# EAGLE design PCB-Main (EAGLE 9.3.1)
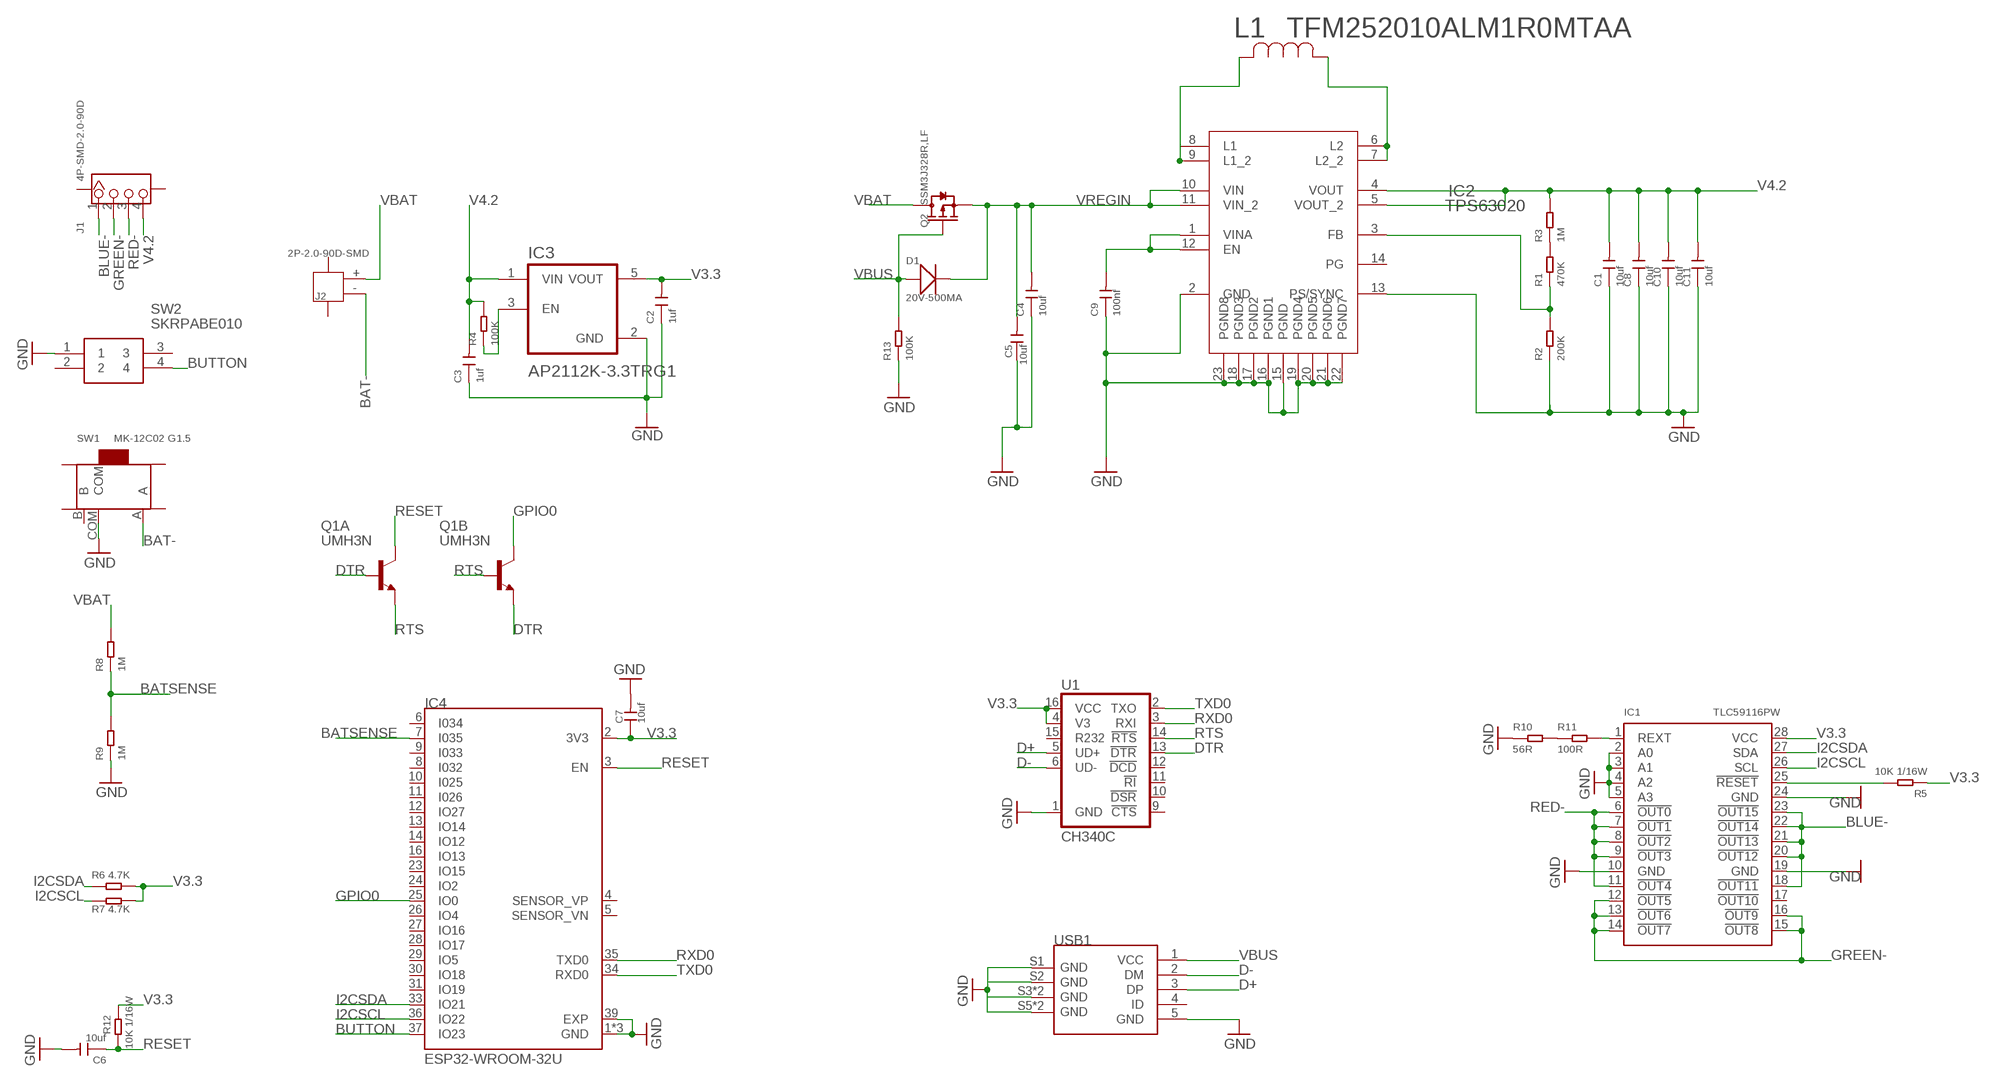
[diagram p0: schematic, sheet 1]

## Parts
C1  10uf  CERAMIC-10UF-6.3V-20%-X5R(0402)  [C0402]
C2  1uf  CERAMIC-1UF-10V-10%-X5R(0402)  [C0402]
C3  1uf  CERAMIC-1UF-10V-10%-X5R(0402)  [C0402]
C4  10uf  CERAMIC-10UF-6.3V-20%-X5R(0402)  [C0402]
C5  10uf  CERAMIC-10UF-6.3V-20%-X5R(0402)  [C0402]
C6  10uf  CERAMIC-10UF-6.3V-20%-X5R(0402)  [C0402]
C7  10uf  CERAMIC-10UF-6.3V-20%-X5R(0402)  [C0402]
C8  10uf  CERAMIC-10UF-6.3V-20%-X5R(0402)  [C0402]
C9  100nf  CERAMIC-100NF-25V-10%-X7R(0402)  [C0402]
C10  10uf  CERAMIC-10UF-6.3V-20%-X5R(0402)  [C0402]
C11  10uf  CERAMIC-10UF-6.3V-20%-X5R(0402)  [C0402]
D1  20V-500MA  SMD-DIODE-SCHOTTKY-20V-500MA(SOD-123)  [SOD-123]
IC1  TLC59116PW  [PW_R-PDSO-G28]
IC2  TPS63020  [QFN14-3X4MM]
IC3  AP2112K-3.3TRG1  [SOT95P285X140-5N]
IC4  ESP32-WROOM-32U  ESP32-WROOM-32UNOSD  [XCVR_ESP32-WROOM-32U]
J1  4P-SMD-2.0-90D  GROVE-CONNECTOR-SMD-90D(4+2P-2.0)  [HW4-SMD-2.0-90D]
J2  2P-2.0-90D-SMD  CONN-HEADER-SMD-PH-SIDE-(2P-2.0MM)  [HW2-SMD-2.0-90D]
L1  TFM252010ALM1R0MTAA  [IND_1008]
Q1  UMH3N  [UMT6]
Q2  SSM3J328R,LF  SMD-MOSFET-P-CH-20V-6A-SSM3J328R(SOT-23)  [SOT-23]
R1  470K  SMD-RES-470K-1%-1/16W(0402)  [R0402]
R2  200K  SMD-RES-200K-5%-1/16W(0402)  [R0402]
R3  1M  SMD-RES-1M-1%-1/16W(0402)  [R0402]
R4  100K  SMD-RES-100K-1%-1/16W(0402)  [R0402]
R5  10K 1/16W  SMD-RES-10K-1%-1/16W(0402)  [R0402]
R6  4.7K  SMD-RES-4.7K-5%-1/16W(0402)  [R0402]
R7  4.7K  SMD-RES-4.7K-5%-1/16W(0402)  [R0402]
R8  1M  SMD-RES-1M-1%-1/16W(0402)  [R0402]
R9  1M  SMD-RES-1M-1%-1/16W(0402)  [R0402]
R10  56R  SMD-RES-56Ω-1%-1/16W(0402)  [R0402]
R11  100R  SMD-RES-100R-5%-1/16W(0402)  [R0402]
R12  10K 1/16W  SMD-RES-10K-1%-1/16W(0402)  [R0402]
R13  100K  SMD-RES-100K-1%-1/16W(0402)  [R0402]
SW1  MK-12C02 G1.5  SMD-TOGGLE-SWITCH-ON-ON(3+4P-6.7X2.7MM)  [SW7-SMD-L6.7X2.7X3.2MM]
SW2  SKRPABE010  [SMT(4.2X3.2)]
U1  CH340C  [SO016]
USB1  10118193-0001LF  MICRO-USB-SMD-B-(10118193-0001LF)  [MICRO-USB5+6P-SMD-0.65-B]

## Nets
BAT-: J2.- SW1.A
BATSENSE: IC4.7(I035) R8.1 R9.2
BLUE-: IC1.18(!OUT11) IC1.20(!OUT12) IC1.21(!OUT13) IC1.22(!OUT14) IC1.23(!OUT15) J1.1
BUTTON: IC4.37(IO23) SW2.4
D+: U1.5(UD+) USB1.3(DP)
D-: U1.6(UD-) USB1.2(DM)
DTR: Q1.2(A:B) Q1.4(B:E) U1.13(!DTR)
GND: C1.1 C2.1 C3.1 C4.1 C5.1 C6.2 C7.2 C8.1 C9.1 C10.1 C11.1 IC1.2(A0) IC1.3(A1) IC1.4(A2) IC1.5(A3) IC1.10(GND) IC1.19(GND) IC1.24(GND) IC2.2(GND) IC2.13(PS/SYNC) IC2.15(PGND) IC2.16(PGND1) IC2.17(PGND2) IC2.18(PGND3) IC2.19(PGND4) IC2.20(PGND5) IC2.21(PGND6) IC2.22(PGND7) IC2.23(PGND8) IC3.2(GND) IC4.1(GND) IC4.15(GND) IC4.38(GND) IC4.39(EXP) R2.1 R9.1 R10.1 R13.1 SW1.COM SW2.1 U1.1(GND) USB1.5(GND) USB1.S1(GND) USB1.S2(GND) USB1.S3(GND) USB1.S4(GND) USB1.S5(GND) USB1.S6(GND)
GPIO0: IC4.25(IO0) Q1.3(B:C)
GREEN-: IC1.12(!OUT5) IC1.13(!OUT6) IC1.14(!OUT7) IC1.15(!OUT8) IC1.16(!OUT9) J1.2
I2CSCL: IC1.26(SCL) IC4.36(IO22) R7.1
I2CSDA: IC1.27(SDA) IC4.33(IO21) R6.1
N$1: C9.2 IC2.1(VINA) IC2.12(EN)
N$2: IC1.1(REXT) R11.2
N$3: R1.2 R3.1
N$4: IC3.3(EN) R4.1
N$5: R10.2 R11.1
N$6: IC2.8(L1) IC2.9(L1_2) L1.2
N$7: IC1.25(!RESET) R5.2
N$8: IC2.6(L2) IC2.7(L2_2) L1.1
N$11: IC2.3(FB) R1.1 R2.2
RED-: IC1.6(!OUT0) IC1.7(!OUT1) IC1.8(!OUT2) IC1.9(!OUT3) IC1.11(!OUT4) J1.3
RESET: C6.1 IC4.3(EN) Q1.6(A:C) R12.1
RTS: Q1.1(A:E) Q1.5(B:B) U1.14(!RTS)
RXD0: IC4.35(TXD0) U1.3(RXI)
TXD0: IC4.34(RXD0) U1.2(TXO)
V3.3: C2.2 C7.1 IC1.28(VCC) IC3.5(VOUT) IC4.2(3V3) R5.1 R6.2 R7.2 R12.2 U1.4(V3) U1.16(VCC)
V4.2: C1.2 C3.2 C8.2 C10.2 C11.2 IC2.4(VOUT) IC2.5(VOUT_2) IC3.1(VIN) J1.4 R3.2 R4.2
VBAT: J2.+ Q2.3(D) R8.2
VBUS: D1.+ Q2.1(G) R13.2 USB1.1(VCC)
VREGIN: C4.2 C5.2 D1.- IC2.10(VIN) IC2.11(VIN_2) Q2.2(S)
Unconnected: IC1.17(!OUT10) IC2.14(PG) IC4.4(SENSOR_VP) IC4.5(SENSOR_VN) IC4.6(I034) IC4.8(I032) IC4.9(I033) IC4.10(I025) IC4.11(I026) IC4.12(IO27) IC4.13(IO14) IC4.14(IO12) IC4.16(IO13) IC4.23(IO15) IC4.24(IO2) IC4.26(IO4) IC4.27(IO16) IC4.28(IO17) IC4.29(IO5) IC4.30(IO18) IC4.31(IO19) J1.SS1 J1.SS2 J2.3 J2.4 SW1.B SW1.SS1 SW1.SS2 SW1.SS3 SW1.SS4 SW2.2 SW2.3 U1.9(!CTS) U1.10(!DSR) U1.11(!RI) U1.12(!DCD) U1.15(R232) USB1.4(ID)

## Library data of the parts
C1 C4-C8 C10 C11 = OPL_Capacitor:CERAMIC-10UF-6.3V-20%-X5R(0402): 302010053; MPN: CC0402MRX5R5BB106
C2 C3 = OPL_Capacitor:CERAMIC-1UF-10V-10%-X5R(0402): 302010040; MPN: CC0402KRX5R6BB105
C9 = OPL_Capacitor:CERAMIC-100NF-25V-10%-X7R(0402): 302010024; MPN: CC0402KRX7R8BB104
D1 = OPL_Discrete_Semiconductor:SMD-DIODE-SCHOTTKY-20V-500MA(SOD-123): 304020032; MPN: SS0520-7-F
IC1 = rfglow-esp32:TLC59116: TLC59116IPWR; MPN: TLC59116IPWR; URL: https://lcsc.com/product-detail/LED-Drivers_TI_TLC59116IPWR_TLC59116IPWR_C131194.html
IC2 = rfglow-esp32:TPS63020: TPS63020DSJR; DESCRIPTION: High Efficiency Single Inductor Buck-Boost Converter with 4A Switch; MF: Texas Instruments; MPN: TPS63020DSJR; PACKAGE: VSON-14 Texas Instruments; URL: https://lcsc.com/product-detail/DC-DC-Converters_TI_TPS63020DSJR_TPS63020DSJR_C15483.html
IC3 = rfglow-esp32:AP2112K-3.3TRG1: AP2112K-3.3TRG1; AVAILABILITY: Unavailable; DESCRIPTION: AP2112 Series 0.6 A 3.3 V Fixed Output SMT LDO Linear Regulator - SOT23-5; MF: Diodes Inc.; MP: AP2112K-3.3TRG1; PACKAGE: SOT-753 Diodes Inc.; PRICE: None
IC4 = rfglow-esp32:ESP32-WROOM-32U: Wi-Fi/BT BLE Module ESP32-D0WD SPI Flash UART U.FL Conn.; AVAILABILITY: Unavailable; DESCRIPTION: Wi-Fi/BT BLE Module ESP32-D0WD SPI Flash UART U.FL Conn.; MF: Espressif Systems; MP: ESP32-WROOM-32U; PACKAGE: Module Espressif Systems; PRICE: None
J1 = OPL_Connector:GROVE-CONNECTOR-SMD-90D(4+2P-2.0): 320110032
J2 = OPL_Connector:CONN-HEADER-SMD-PH-SIDE-(2P-2.0MM): 320110026
L1 = rfglow-esp32:TFM252010ALM1R0MTAA: 303010527
Q1 = rfglow-esp32:UMH3N: UMH3NTN; MPN: UMH3NTN; URL: https://lcsc.com/product-detail/Digital-Transistors_ROHM_UMH3NTN_UMH3NTN_C123008.html
Q2 = OPL_Discrete_Semiconductor:SMD-MOSFET-P-CH-20V-6A-SSM3J328R(SOT-23): 305030075; MPN: SSM3J328R,LF
R1 = OPL_Resistor:SMD-RES-470K-1%-1/16W(0402): 301010069; MPN: RC0402FR-07470KL
R2 = OPL_Resistor:SMD-RES-200K-5%-1/16W(0402): 301012017; MPN: RC0402JR-070RL; VALUE: 0R
R3 R8 R9 = rfglow-esp32:SMD-RES-1M-1%-1/16W(0402): 301010043; MPN: RC0402FR-071ML
R4 R13 = OPL_Resistor:SMD-RES-100K-1%-1/16W(0402): 301010456; MPN: RC0402FR-07100KL
R5 R12 = OPL_Resistor:SMD-RES-10K-1%-1/16W(0402): 301010047; MPN: RC0402FR-0710KL
R6 R7 = rfglow-esp32:SMD-RES-4.7K-5%-1/16W(0402): 301010010; MPN: RC0402JR-074K7L
R10 = rfglow-esp32:SMD-RES-56Ω-1%-1/16W(0402): RC0402FR-0756RL; MPN: RC0402FR-0756RL
R11 = rfglow-esp32:SMD-RES-100R-5%-1/16W(0402): 301010028; MPN: RC0402JR-07100RL
SW1 = OPL_Switch:SMD-TOGGLE-SWITCH-ON-ON(3+4P-6.7X2.7MM): 311030001; MPN: MK-12C02 G1.5
SW2 = rfglow-esp32:SKRPABE010: 311020518; DESCRIPTION: Switch Tactile 4.2 x 3.2mm SMT 1.57N Black Button Tactile Switch, SPST-NO 0.05 A 0.7mm; HEIGHT: mm; MANUFACTURER_NAME: ALPS; MANUFACTURER_PART_NUMBER: SKRPABE010; MOUSER_PART_NUMBER: 688-SKRPAB; MOUSER_PRICE-STOCK: https://www.mouser.com/Search/Refine.aspx?Keyword=688-SKRPAB; RS_PART_NUMBER: 9174087; RS_PRICE-STOCK: http://uk.rs-online.com/web/p/products/9174087
U1 = rfglow-esp32:CH340C: CH340C; MPN: CH340C; PROD_ID: IC-14038; URL: https://lcsc.com/product-detail/USB_CH340C_C84681.html
USB1 = OPL_Connector:MICRO-USB-SMD-B-(10118193-0001LF): 320010003; MPN: 10118193-0001LF

## Board
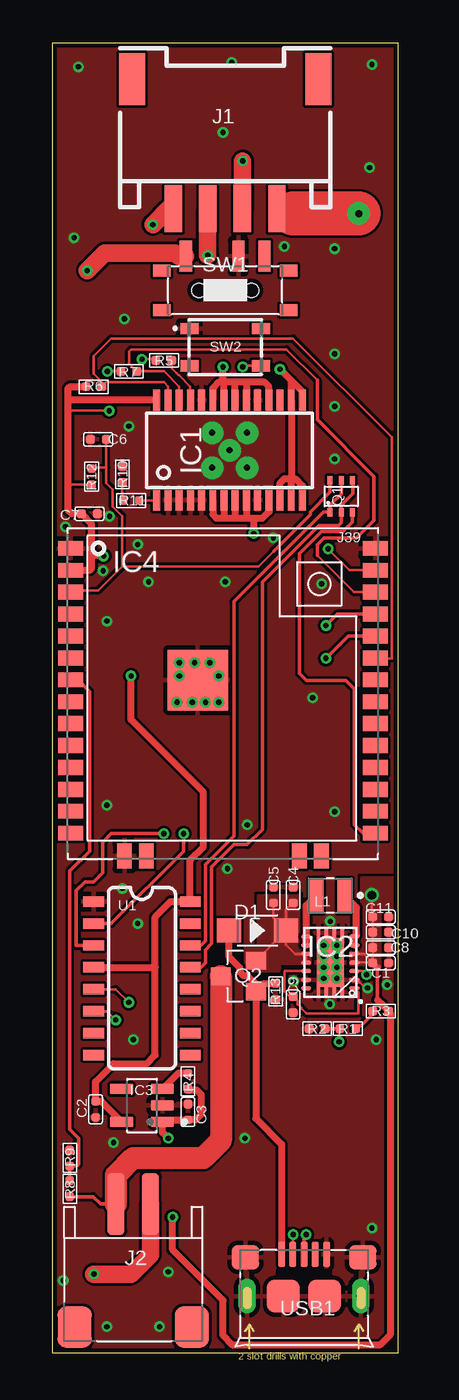
[diagram p1: board, top side]
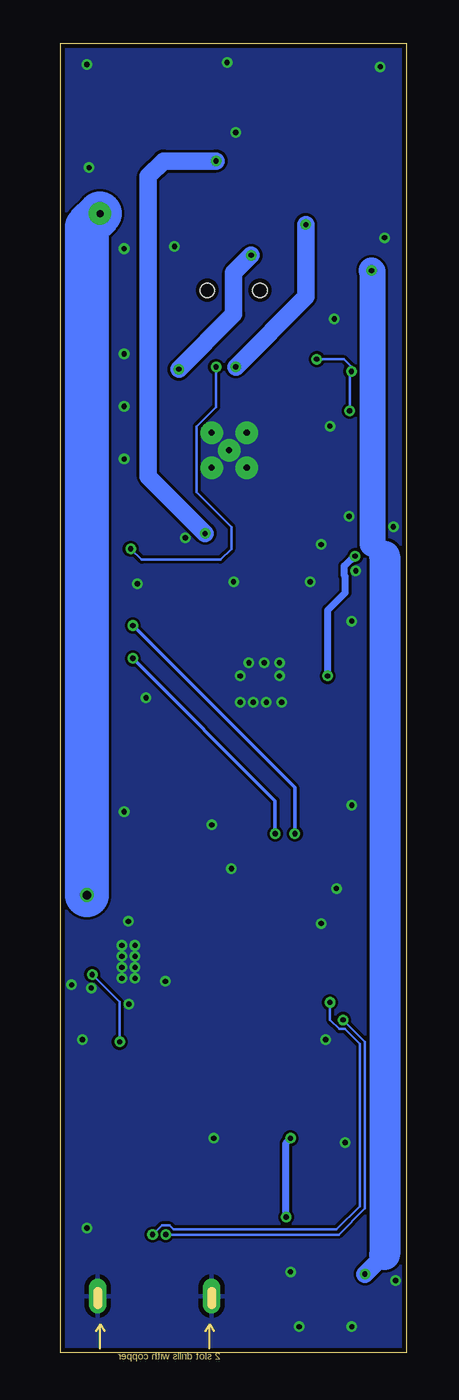
[diagram p2: board, bottom side, seen from below]

Size 20.07 x 75.92 mm. Coordinates in mm from the lower left corner, seen from the top.
Outline: 0,0 20.07,0 20.07,75.92 0,75.92 0,0
Copper layers (1*16): Top 0.035mm / dielectric 1.5mm / Bottom 0.035mm
Design rules "SeeedStudio_2layer_DRU_no_angle_20140221 *": minimum track width 6mil, minimum drill 12mil, track to track 6mil, track to pad 6mil, pad to pad 6mil, via to via 6mil, smd to smd 0mil, copper to edge 10mil, drill to drill 10mil, minimum pad ring 10mil, minimum via ring 6mil, stop-mask expansion 2mil, vias tented up to drill 100mil, thermal gap 10mil

### Footprints (pad centres in the part's own frame; a part is rotated, then mirrored left to right if it is on the bottom)
C0402 = smd 0.5 x 0.5: 1 0,0.463; 2 0,-0.463
SOD-123 = smd 1.397 x 1.397: + -1.651,0; - 1.651,0
PW_R-PDSO-G28 = smd 0.4 x 1.2: 1 -4.225,-2.9; 2 -3.575,-2.9; 3 -2.925,-2.9; 4 -2.275,-2.9; 5 -1.625,-2.9; 6 -0.975,-2.9; 7 -0.325,-2.9; 8 0.325,-2.9; 9 0.975,-2.9; 10 1.625,-2.9; 11 2.275,-2.9; 12 2.925,-2.9; 13 3.575,-2.9; 14 4.225,-2.9; 15 4.225,2.9; 16 3.575,2.9; 17 2.925,2.9; 18 2.275,2.9; 19 1.625,2.9; 20 0.975,2.9; 21 0.325,2.9; 22 -0.325,2.9; 23 -0.975,2.9; 24 -1.625,2.9; 25 -2.275,2.9; 26 -2.925,2.9; 27 -3.575,2.9; 28 -4.225,2.9
QFN14-3X4MM = smd 0.6 x 0.24: 1 -1.4,1.5; 2 -1.4,1; 3 -1.4,0.5; 4 -1.4,0; 5 -1.4,-0.5; 6 -1.4,-1; 7 -1.4,-1.5; 8 1.4,-1.5; 9 1.4,-1; 10 1.4,-0.5; 11 1.4,0; 12 1.4,0.5; 13 1.4,1; 14 1.4,1.5 | smd 1.58 x 2.85: 15 0,0 | smd 0.2 x 0.575: 16 -0.69,1.712; 17 -0.23,1.712; 18 0.23,1.712; 19 0.69,1.712; 20 0.69,-1.712; 21 0.23,-1.712; 22 -0.23,-1.712; 23 -0.69,-1.712
SOT95P285X140-5N = smd 1.35 x 0.6: 1 -1.185,0.95; 2 -1.185,0; 3 -1.185,-0.95; 4 1.185,-0.95; 5 1.185,0.95
XCVR_ESP32-WROOM-32U = smd 1.45 x 0.86: 1 -8.83,8.41; 2 -8.83,7.14; 3 -8.83,5.87; 4 -8.83,4.6; 5 -8.83,3.33; 6 -8.83,2.06; 7 -8.83,0.79; 8 -8.83,-0.48; 9 -8.83,-1.75; 10 -8.83,-3.02; 11 -8.83,-4.29; 12 -8.83,-5.56; 13 -8.83,-6.83; 14 -8.83,-8.1; 25 8.83,-8.1; 26 8.83,-6.83; 27 8.83,-5.56; 28 8.83,-4.29; 29 8.83,-3.02; 30 8.83,-1.75; 31 8.83,-0.48; 32 8.83,0.79; 33 8.83,2.06; 34 8.83,3.33; 35 8.83,4.6; 36 8.83,5.87; 37 8.83,7.14; 38 8.83,8.41 | smd 0.86 x 1.45: 15 -5.715,-9.43; 16 -4.445,-9.43; 23 4.445,-9.43; 24 5.715,-9.43 | smd 3.5 x 3.5: 39 -1.46,0.77
HW4-SMD-2.0-90D = smd 1.01 x 2.74: 1 -3,-0.1; 2 -1,-0.1; 3 1,-0.1; 4 3,-0.1 | smd 1.5 x 3: SS1 -5.4,7.4; SS2 5.4,7.4
HW2-SMD-2.0-90D = smd 2 x 2.4: 3 3.4,-2.181; 4 -3.4,-2.181 | smd 1 x 3.6: + -1,4.953; - 1,4.953
IND_1008 = smd 0.85 x 2: 1 -0.825,0; 2 0.825,0
UMT6 = smd 0.5 x 0.3: 1 -0.925,0.65; 2 -0.925,0; 3 -0.925,-0.65; 4 0.925,-0.65; 5 0.925,0; 6 0.925,0.65
SOT-23 = smd 1.016 x 1.143: 1 -0.889,-1.016; 2 0.889,-1.016; 3 0,1.016
R0402 = smd 0.5 x 0.5: 1 0,0.463; 2 0,-0.463
SW7-SMD-L6.7X2.7X3.2MM = smd 1.8 x 0.7: A 1.978,2.286; B 1.978,-2.286; COM 1.978,-0.762 | smd 0.7 x 1.016: SS1 -1.15,-3.683; SS2 1.15,-3.683; SS3 1.15,3.683; SS4 -1.15,3.683 | hole 0.813: 0,-1.524; 0,1.524
SMT(4.2X3.2) = smd 1.05 x 0.65: 1 -2.075,1.075; 2 2.075,1.075; 3 -2.075,-1.075; 4 2.075,-1.075
SO016 = smd 0.6 x 1.2: 1 -4.445,-2.8; 2 -3.175,-2.8; 3 -1.905,-2.8; 4 -0.635,-2.8; 5 0.635,-2.8; 6 1.905,-2.8; 7 3.175,-2.8; 8 4.445,-2.8; 9 4.445,2.8; 10 3.175,2.8; 11 1.905,2.8; 12 0.635,2.8; 13 -0.635,2.8; 14 -1.905,2.8; 15 -3.175,2.8; 16 -4.445,2.8
MICRO-USB5+6P-SMD-0.65-B = smd 0.4 x 1.5: 1 -1.3,-0.25; 2 -0.65,-0.25; 3 0,-0.25; 4 0.65,-0.25; 5 1.3,-0.25 | smd 1.6 x 1.4: S1 -3.4,-0.427; S6 3.4,-0.427 | drill 0.508 pad 1.016 long: S2 -3.3,-2.675; S5 3.3,-2.675 | smd 1.9 x 1.9: S3 -1.2,-2.675; S4 1.2,-2.675

### Placement (x,y rotation side)
C1  19.05,22.61 270 top
C2  2.51,14.12 180 top
C3  7.87,13.97 0 top
C4  13.97,26.54 0 top
C5  12.83,26.54 0 top
C6  2.67,52.96 270 top
C7  2.16,48.64 90 top
C8  19.05,23.5 270 top
C9  13.97,20.19 180 top
C10  19.05,24.38 270 top
C11  19.05,25.27 270 top
D1  11.91,24.49 0 top
IC1  10.29,52.32 0 top
IC2  16.13,22.63 180 top
IC3  5.21,14.35 180 top
IC4  9.9,38.23 0 top
J1  10.03,66.42 0 top
J2  4.7,3.68 0 top
L1  16.13,26.52 180 top
Q1  16.76,49.66 90 top
Q2  10.79,21.84 90 top
R1  17.14,18.8 90 top
R2  15.37,18.8 90 top
R3  19.05,19.81 90 top
R4  7.87,15.75 0 top
R5  6.48,57.53 90 top
R6  2.41,56.01 270 top
R7  4.45,56.9 270 top
R8  1.02,9.53 0 top
R9  1.02,11.3 0 top
R10  4.06,50.93 0 top
R11  4.57,49.4 90 top
R12  2.29,50.8 0 top
R13  12.95,20.95 180 top
SW1  10.03,61.59 90 top
SW2  10.03,58.29 0 top
U1  5.21,21.72 270 top
USB1  14.61,5.97 0 top

### Tracks (layer width: path | path; a pad name or v marks a point on that pad's centre or on a via)
BAT-  (via drill 0.3)
  Top 1.016: SW1.A 7.31,63.57 7.13,63.76 3.05,63.76 v2.03,62.74 | v2.41,4.57 4.57,4.57 5.7,5.7 J2.-
  Bottom 1.016: 1.98,46.89 1.27,46.18 | 1.27,5.71 v2.41,4.57
  Bottom 1.5: v2.03,62.74 1.98,62.69 1.98,46.89
  Bottom 1.8: 1.27,46.18 1.27,5.71
BATSENSE
  Top 0.2: R8.1 R9.2 1.44,10.84 1.52,10.92 1.52,12.45 1.02,12.95 1.02,27.94 2.16,29.08
  Top 0.203: 2.16,29.08 2.16,38.35 1.5,39.02 IC4.7
BLUE-  (via drill 0.3)
  Top 0.406: IC1.18 12.56,56.02 12.32,56.26 11.3,56.26 | 11.3,56.26 10.54,56.26 | 10.54,56.26 9.91,56.26 | 9.91,56.26 9.65,56.26 9.31,55.92 IC1.23 | IC1.22 9.96,56.2 9.91,56.26 | IC1.21 10.61,56.19 10.54,56.26 | IC1.20 11.3,55.27 11.3,56.26 | 9.91,56.26 v9.91,57.15
  Top 1.016: v5.84,65.41 6.76,66.32 J1.1
  Bottom 1.016: v9.91,57.15 5.84,61.21 v5.84,65.41
BUTTON  (via drill 0.3)
  Top 0.152: SW2.4 11.12,57.22 v11.05,57.15 | v16,46.61 17.24,45.37 IC4.37
  Bottom 0.152: v11.05,57.15 11.05,54.84 12.18,53.7 12.18,49.9 10.16,47.88 10.16,46.61 10.79,45.97 15.37,45.97 v16,46.61
D+  (via drill 0.3)
  Top 0.152: U1.5 3.68,21.08 v4.45,20.32
  Top 0.203: USB1.3 14.61,6.73 v14.73,6.86
  Bottom 0.152: v4.45,20.32 4.45,19.31 3.9,18.77 3.58,18.77 2.72,17.91 2.72,8.51 4.06,7.16 13.52,7.16 13.75,7.39 14.19,7.39 v14.72,6.86 v14.73,6.86
D-  (via drill 0.3)
  Top 0.152: U1.6 3.17,19.81 v3.68,19.3 | v13.97,6.86 13.97,5.73 USB1.2
  Bottom 0.152: v3.68,19.3 2.41,18.03 2.41,8.38 3.94,6.86 v13.97,6.86
DTR
  Top 0.2: 15.97,47.95 16.59,47.95 16.76,48.13 Q1.2 | 16.76,49.15 17.42,49.81 17.42,50.57
  Top 0.203: Q1.4 17.42,50.57 | Q1.2 16.76,49.15 | 15.97,47.95 15.45,47.95 12.19,44.69 12.19,30.35 11.3,29.46 10.54,29.46 9.25,28.17 9.25,23.73 8.89,23.37 8.89,22.61 8.64,22.35 U1.13
GND  (via drill 0.3, 0.3 pad 0.3, 0.35 pad 1.3)
  Top 0.152: IC2.2 17.68,21.48 17.85,21.48 18.18,21.16 v18.29,21.16
  other vias: 10.29,52.32 11.3,53.34 9.27,51.31 9.27,53.34 11.3,51.31 0.76,47.88 2.95,45.34 4.45,53.72 12.83,47.24 16.38,54.86 5.59,44.7 4.95,46.86 15.62,44.58 4.06,26.92 11.3,30.61 10.16,28.07 19.43,21.34 16.1,20.22 16.13,25.02 14,21.54 3.33,48.49 3.56,12.19 18.8,18.16 15.75,23.62 16.51,23.62 15.75,22.99 16.51,22.99 15.75,22.35 16.51,22.35 15.75,21.72 16.51,21.72 4.7,18.16 4.95,24.89 3.17,31.75 16.38,31.37 7.37,40.01 8.26,40.01 9.14,40.01 9.65,39.24 7.24,37.72 8.13,37.72 8.89,37.72 9.65,37.72 7.37,39.24 4.19,59.94 16.38,57.91 1.27,64.64 18.41,68.71 1.52,74.55 18.54,74.68 18.54,7.24 3.17,1.52 6.22,1.52 0.64,4.19 6.73,4.7 11.18,12.45 15.11,37.97 3.17,42.42 10.03,44.7 16.38,51.82 16.38,64.01 13.46,64.14 9.91,70.74 10.41,74.8
  pour Top (isolate 0.127, rank 3): 0,0 20.07,0 20.07,75.95 0,75.95
  pour Bottom (isolate 0.127, rank 3): 0,0 20.07,0 20.07,75.95 0,75.95
GPIO0
  Top 0.2: 14.35,39.37 14.73,38.99 17.02,38.99 17.53,38.48 17.53,30.61 18.01,30.13 IC4.25
  Top 0.203: Q1.3 17.41,48.15 16.87,47.6 15.6,47.6 14.35,46.35 14.35,39.37
GREEN-  (via drill 0.3)
  Top 0.406: IC1.12 13.21,50.42 13.46,50.67 13.84,50.67 | 13.84,50.67 14.1,50.67 14.51,50.26 IC1.14 | IC1.13 13.86,50.65 13.84,50.67 | 13.84,50.67 13.86,50.69 IC1.16 13.86,56.37 v13.21,57.02 14.51,55.72 IC1.15
  Top 1.016: v9.02,63.63 9.02,66.31 J1.2
  Bottom 1.016: v13.21,57.02 10.03,60.2 10.03,62.61 v9.02,63.63
I2CSCL
  Top 0.152: IC1.26 7.37,56.01 6.48,56.9 R7.1 4.45,57.36 4.45,58.04 4.57,58.17 13.59,58.17 15.37,56.39 | 15.37,46.23 17.5,44.1 IC4.36
  Top 0.203: 15.37,46.23 15.37,46.86 15.75,47.24 17.65,47.24 18.67,48.26 18.67,50.8 15.37,54.1 15.37,56.39
I2CSDA
  Top 0.152: IC1.27 6.71,56.03 6.48,56.26 3.13,56.26 R6.1 2.88,56.31 2.41,56.77 2.41,57.78 3.43,58.8 13.97,58.8 19.68,53.09 19.68,40.26 18.64,40.26 IC4.33
N$1
  Top 0.152: IC2.12 13.49,22.13 13.46,22.1 13.46,20.95 13.76,20.66 C9.2 14.22,20.4 14.22,20.21 14.24,20.21 14.45,20 14.45,19.97 14.73,19.68 17.75,19.68 17.75,20.91 IC2.1
N$2
  Top 0.152: IC1.1 6.04,49.4 R11.2
N$3
  Top 0.203: R1.2 17.76,18.94 17.89,18.94 18.59,19.64 R3.1
N$4
  Top 0.406: R4.1 7.3,16.21 IC3.3
N$5
  Top 0.152: R11.1 4.06,49.45 R10.2
N$6
  Top 0.406: IC2.9 IC2.8 14.73,25.95 L1.2
N$7
  Top 0.152: IC1.25 8,55.23 8,56.01 7.34,56.66 7.2,56.8 6.94,57.07 R5.2
N$8
  Top 0.406: IC2.6 IC2.7 17.65,24.25 17.65,25.82 L1.1
N$11  (via drill 0.3, 0.3 pad 0.3)
  Top 0.152: v16.64,18.03 16.64,18.75 R1.1 | v18.23,21.93 18.04,22.13 IC2.3
  Top 0.203: R1.1 R2.2
  Bottom 0.152: v18.23,21.93 16.64,20.34 v16.64,18.03
RED-  (via drill 0.3)
  Top 0.406: IC1.6 9.31,48.6 9.53,48.39 10.03,48.39 | 10.03,48.39 10.67,48.39 | 10.67,48.39 11.3,48.39 | 11.3,48.39 11.68,48.39 | 11.68,48.39 12.19,48.39 12.57,48.77 12.56,48.78 IC1.11 | IC1.7 9.96,48.46 10.03,48.39 | IC1.8 10.61,48.44 10.67,48.39 | IC1.9 11.26,48.43 11.3,48.39 | 11.68,48.39 v11.68,47.5
  Top 1.016: v11.05,69.09 11.05,66.34 J1.3
  Bottom 1.016: v11.68,47.5 14.99,50.8 14.99,68.2 14.1,69.09 v11.05,69.09
RESET
  Top 0.152: IC4.3 1.05,44.2 2.67,44.2 4.06,45.59 | 3.13,51.31 3.13,50.42 3.51,50.04 3.51,49.07 4.06,48.51 4.06,45.59 | 3.13,51.31 C6.1 | R12.1 2.33,51.31 3.13,51.31 | 12.86,46.48 11.97,45.59 4.06,45.59
  Top 0.203: Q1.6 16.11,49.9 14.97,48.75 14.97,48.59 12.86,46.48
RTS
  Top 0.2: 15.51,48.51 15.73,48.73 Q1.1 | 16.11,49.13 16.76,49.78 Q1.5
  Top 0.203: Q1.1 16.11,49.13 | 15.51,48.51 10.54,43.55 10.54,29.97 8.89,28.32 8.89,23.88 8.64,23.62 U1.14
RXD0  (via drill 0.3)
  Top 0.203: IC4.35 16.54,42.83 v15.88,42.16 | v6.48,30.1 3.43,30.1 2.92,29.59 2.92,27.81 2.41,27.3 1.91,27.3 1.4,26.8 1.4,23.62 U1.3
  Bottom 0.203: v15.88,42.16 6.48,32.77 v6.48,30.1
TXD0  (via drill 0.3)
  Top 0.203: IC4.34 17.17,41.56 v15.88,40.26 | v7.62,30.1 7.62,29.08 3.43,24.89 U1.2
  Bottom 0.203: v15.88,40.26 7.62,32 v7.62,30.1
V3.3  (via drill 0.3)
  Top 0.152: R12.2 0.92,50.34 | 0.92,54.61 v3.3,54.61 | v5.21,57.6 5.94,57.6 R5.1 | v3.2,56.9 R7.2
  Top 0.406: IC4.2 2.19,45.37 2.29,45.47 2.29,46.23 | R6.2 1.02,56.01 0.92,55.91 0.92,55.24 | 0.92,55.24 0.92,54.61 0.92,50.34 0.92,48.87 1.14,48.64 C7.1 2.02,48.32 2.29,48.05 2.29,46.23 | IC1.28 0.94,55.22 0.92,55.24 | IC3.5 2.84,14.59 C2.2 2.52,15.72 3.56,16.76 5.46,16.76 5.97,17.27 5.97,22.35 | 5.97,22.35 5.97,25.27 6.86,26.16 U1.16 8.01,28.58 8.76,29.34 8.76,32.51 4.57,36.7 v4.57,39.24 | U1.4 5.97,22.35 | v2.98,46.19 2.94,46.23 2.29,46.23
  Bottom 0.152: v5.21,57.6 3.63,57.6 3.2,57.17 v3.2,56.9 3.3,56.79 v3.3,54.61
  Bottom 0.406: v4.57,39.24 4.57,43.05 3.56,44.07 3.56,45.02 3.61,45.06 3.61,45.61 3.22,46 3.17,46 v2.98,46.19
V4.2  (via drill 0.3, 0.4 pad 1.3, 0.5)
  Top 0.152: IC2.5 18.06,23.13 C1.2 | IC2.4 18.56,22.63 C1.2 | C1.2 C8.2 C10.2 C11.2 18.54,25.32 v18.54,26.54 | J1.4 13.69,66.32 13.97,66.04
  Top 0.202: 18.87,22.33 18.87,20.46
  Top 0.406: v6.99,7.87 6.99,5.97 9.91,3.05 9.91,1.02 10.46,0.46 19,0.46 19.61,1.07 19.61,19.72 R3.2 19.19,20.13 19.19,20.14 18.91,20.42 18.87,20.46 | v6.73,12.45 6.39,12.79 IC3.1 6.5,13.51 C3.2 8.3,13.51 8.64,13.84 8.64,14.99 8.38,15.24 7.92,15.24 R4.2 | 18.87,22.33 C1.2
  Top 2.54: v17.78,66.04 13.97,66.04
  Bottom 0.406: v6.99,7.87 6.99,12.19 v6.73,12.45
  Bottom 2.54: v17.78,66.04 18.54,65.28 v18.54,26.54
  pour Top (isolate 0.127, no thermals): 17.27,23.24 17.27,22.48 18.03,22.48 18.03,22.35 19.05,22.35 19.05,25.78 19.81,25.78 19.81,27.56 17.91,27.56 17.91,23.24
VBAT
  Top 0.203: R8.2 2.37,9.06 2.79,8.64 J2.+
  Top 1.27: J2.+ 3.7,10.3 4.7,11.3 8.76,11.3 9.78,12.32 Q2.3
VBUS
  Top 0.406: D1.+ 10.26,22.94 10.88,22.32 10.88,22.08 11.09,21.87 11.34,21.87 11.81,21.39 Q2.1 | Q2.1 12.27,21.42 R13.2 | Q2.1 11.81,13.59 13.3,12.1 USB1.1
VREGIN
  Top 0.152: IC2.11 IC2.10 14.08,23.13 13.56,23.65 D1.- | Q2.2 D1.- | D1.- 12.83,25.22 C5.2 | D1.- 13.56,25.67 C4.2
  pour Top (isolate 0.127, no thermals): 13.21,22.1 11.18,22.1 11.18,23.5 11.94,23.5 11.94,26.54 14.35,26.54 14.35,23.24 14.99,23.24 14.99,22.53 13.21,22.53